# Altium schematic sheet ValdisMainboardSchematic.SchDoc
size A4; SheetNumber: 1; SheetTotal: 2; SPICEModelCacheLFLNMATP: <root> / <DocumentId>LFLNMATP</DocumentId> / </root>
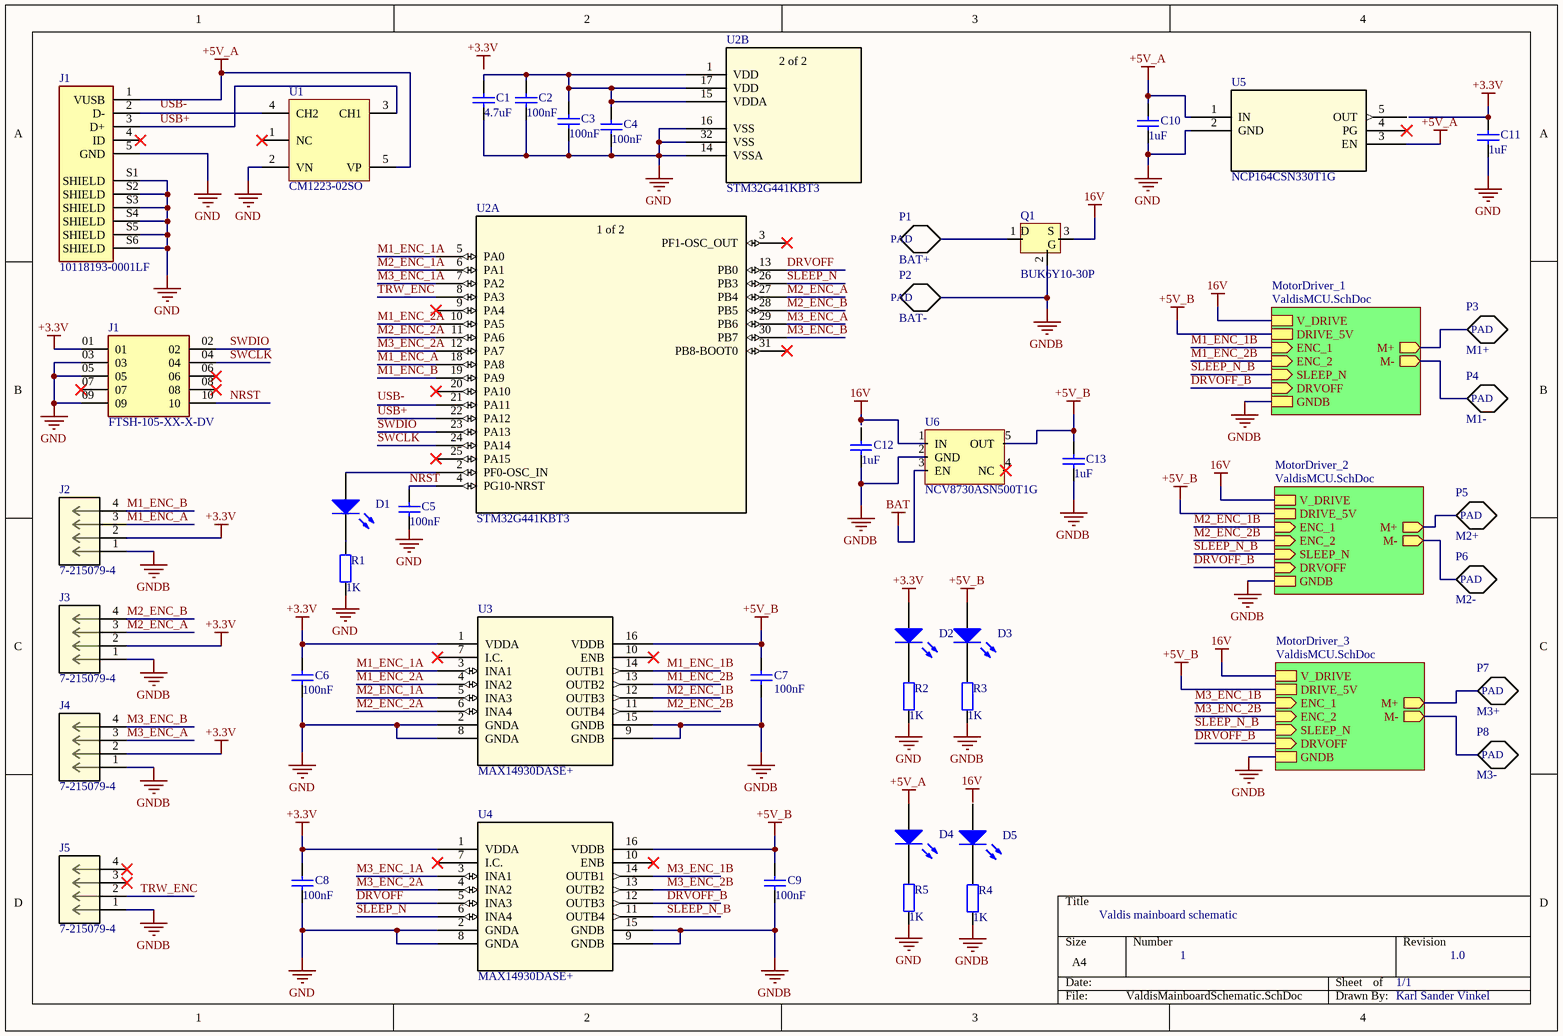
[diagram p0: ValdisMainboardSchematic.SchDoc]

## Parts
(Parts that share a designator on the sheet are numbered #1, #2 ... from top to bottom, then left to right.)
C1  value 4.7uF  (hidden comment: Capacitor)
C2  value 100nF  (hidden comment: Capacitor)
C3  value 100nF  (hidden comment: Capacitor)
C4  value 100nF  (hidden comment: Capacitor)
C5  value 100nF  (hidden comment: Capacitor)
C6  value 100nF  (hidden comment: Capacitor)
C7  value 100nF  (hidden comment: Capacitor)
C8  value 100nF  (hidden comment: Capacitor)
C9  value 100nF  (hidden comment: Capacitor)
C10  value 1uF  (hidden comment: Capacitor)
C11  value 1uF  (hidden comment: Capacitor)
C12  value 1uF  (hidden comment: Capacitor)
C13  value 1uF  (hidden comment: Capacitor)
D1  Light-Emitting Diode  (value not drawn)
D2  Light-Emitting Diode  (value not drawn)
D3  Light-Emitting Diode  (value not drawn)
D4  Light-Emitting Diode  (value not drawn)
D5  Light-Emitting Diode  (value not drawn)
J1#1  10118193-0001LF  [FCI_10118193-0001LF]
J1#2  FTSH-105-XX-X-DV  [SAMTEC_FTSH-105-XX-X-DV]
J2  7-215079-4  [CONN_7-215079-4_TEC]
J3  7-215079-4  [CONN_7-215079-4_TEC]
J4  7-215079-4  [CONN_7-215079-4_TEC]
J5  7-215079-4  [CONN_7-215079-4_TEC]
P1  BAT+
P2  BAT-
P3  M1+
P4  M1-
P5  M2+
P6  M2-
P7  M3+
P8  M3-
Q1  BUK6Y10-30P  [BUK6Y10-30P]
R1  value 1K  [AXIAL-0.4]  (hidden comment: Res2)
R2  value 1K  [AXIAL-0.4]  (hidden comment: Res2)
R3  value 1K  [AXIAL-0.4]  (hidden comment: Res2)
R4  value 1K  [AXIAL-0.4]  (hidden comment: Res2)
R5  value 1K  [AXIAL-0.4]  (hidden comment: Res2)
U1  CM1223-02SO  [ONSC-SOT23-5-527AH-01_L]
U2  STM32G441KBT3  [LQFP32_7X7_STM]  (parts A,B of 2)
U3  MAX14930DASE+  [21-0041_S16+1_MXM]
U4  MAX14930DASE+  [21-0041_S16+1_MXM]
U5  NCP164CSN330T1G  [FP-NCP164CSN330T1G_OSI]
U6  NCV8730ASN500T1G

## Sub-sheets
MotorDriver_1 = ValdisMCU.SchDoc: V_DRIVE, SLEEP_N (in), ENC_1 (in), ENC_2 (in), M+ (out), M- (out), DRVOFF (in), GNDB, DRIVE_5V
MotorDriver_2 = ValdisMCU.SchDoc: V_DRIVE, SLEEP_N (in), ENC_1 (in), ENC_2 (in), M+ (out), M- (out), DRVOFF (in), GNDB, DRIVE_5V
MotorDriver_3 = ValdisMCU.SchDoc: V_DRIVE, SLEEP_N (in), ENC_1 (in), ENC_2 (in), M+ (out), M- (out), DRVOFF (in), GNDB, DRIVE_5V

## Nets
16V: Q1.3 U6.1(IN) ; sheet MotorDriver_1/V_DRIVE, sheet MotorDriver_2/V_DRIVE, sheet MotorDriver_3/V_DRIVE
+3.3V: C6.2 C8.2 C11.2 D2.1(A) J1#2.01 J2.2 J3.2 J4.2 U3.1(VDDA) U4.1(VDDA)
+5V_A: C10.2 D4.1(A) J1#1.1(VUSB) U1.5(VP) U5.1(IN) U5.3(EN)
+5V_B: C7.2 C9.2 C13.2 D3.1(A) U3.16(VDDB) U4.16(VDDB) U6.5(OUT) ; sheet MotorDriver_1/DRIVE_5V, sheet MotorDriver_2/DRIVE_5V, sheet MotorDriver_3/DRIVE_5V
BAT: U6.3(EN)
GND: C1.1 C2.1 C3.1 C4.1 C6.1 C8.1 C10.1 C11.1 J1#1.5(GND) J1#1.S1(SHIELD) J1#1.S2(SHIELD) J1#1.S3(SHIELD) J1#1.S4(SHIELD) J1#1.S5(SHIELD) J1#1.S6(SHIELD) J1#2.03 J1#2.05 J1#2.09 R1.1 R2.1 R5.1 U1.2(VN) U2.14(VSSA) U2.16(VSS) U2.32(VSS) U3.2(GNDA) U3.8(GNDA) U4.2(GNDA) U4.8(GNDA) U5.2(GND)
GNDB: C7.1 C9.1 C12.1 C13.1 J2.1 J3.1 J4.1 J5.1 P2.?1 Q1.2 R3.1 R4.1 U3.9(GNDB) U3.15(GNDB) U4.9(GNDB) U4.15(GNDB) U6.2(GND) ; sheet MotorDriver_1/GNDB, sheet MotorDriver_2/GNDB, sheet MotorDriver_3/GNDB
DRVOFF: U2.13(PB0) U4.5(INA3)
DRVOFF_B: U4.12(OUTB3) ; sheet MotorDriver_1/DRVOFF, sheet MotorDriver_2/DRVOFF, sheet MotorDriver_3/DRVOFF
M1_ENC_1A: U2.5(PA0) U3.3(INA1)
M1_ENC_1B: U3.14(OUTB1) ; sheet MotorDriver_1/ENC_1
M1_ENC_2A: U2.10(PA5) U3.4(INA2)
M1_ENC_2B: U3.13(OUTB2) ; sheet MotorDriver_1/ENC_2
M1_ENC_A: J2.3 U2.18(PA8)
M1_ENC_B: J2.4 U2.19(PA9)
M2_ENC_1A: U2.6(PA1) U3.5(INA3)
M2_ENC_1B: U3.12(OUTB3) ; sheet MotorDriver_2/ENC_1
M2_ENC_2A: U2.11(PA6) U3.6(INA4)
M2_ENC_2B: U3.11(OUTB4) ; sheet MotorDriver_2/ENC_2
M2_ENC_A: J3.3 U2.27(PB4)
M2_ENC_B: J3.4 U2.28(PB5)
M3_ENC_1A: U2.7(PA2) U4.3(INA1)
M3_ENC_1B: U4.14(OUTB1) ; sheet MotorDriver_3/ENC_1
M3_ENC_2A: U2.12(PA7) U4.4(INA2)
M3_ENC_2B: U4.13(OUTB2) ; sheet MotorDriver_3/ENC_2
M3_ENC_A: J4.3 U2.29(PB6)
M3_ENC_B: J4.4 U2.30(PB7)
NRST: C5.2 J1#2.10 U2.4(PG10-NRST)
SLEEP_N: U2.26(PB3) U4.6(INA4)
SLEEP_N_B: U4.11(OUTB4) ; sheet MotorDriver_1/SLEEP_N, sheet MotorDriver_2/SLEEP_N, sheet MotorDriver_3/SLEEP_N
SWCLK: J1#2.04 U2.24(PA14)
SWDIO: J1#2.02 U2.23(PA13)
TRW_ENC: J5.2 U2.8(PA3)
USB+: J1#1.3(D+) U1.3(CH1) U2.22(PA12)
NetC1_2: C1.2 C2.2 C3.2 C4.2 U2.1(VDD) U2.15(VDDA) U2.17(VDD)
NetD1_1: D1.1(A) U2.2(PF0-OSC_IN)
NetD1_2: D1.2(K) R1.2
NetD2_2: D2.2(K) R2.2
NetD3_2: D3.2(K) R3.2
NetD4_2: D4.2(K) R5.2
NetD5_2: D5.2(K) R4.2
NetJ1#1_2: J1#1.2(D-) U1.4(CH2)
NetP1_?1: P1.?1 Q1.1
NetP3_?1: P3.?1 ; sheet MotorDriver_1/M+
NetP4_?1: P4.?1 ; sheet MotorDriver_1/M-
NetP5_?1: P5.?1 ; sheet MotorDriver_2/M+
NetP6_?1: P6.?1 ; sheet MotorDriver_2/M-
NetP7_?1: P7.?1 ; sheet MotorDriver_3/M+
NetP8_?1: P8.?1 ; sheet MotorDriver_3/M-

Not connected (* = marked no-connect by the designer): C5 1; C12 2; D5 1(A); J1#1 4(ID)*; J1#2 06* 07* 08*; J5 3* 4*; U1 1(NC)*; U2 3(PF1-OSC_OUT)* 9(PA4)* 20(PA10)* 21(PA11) 25(PA15)* 31(PB8-BOOT0)*; U3 7(I.C.)* 10(ENB)*; U4 7(I.C.)* 10(ENB)*; U5 4(PG)* 5(OUT); U6 4(NC)*

## Notes on the sheet
- Valdis mainboard schematic
- 1
- 1/1
- 1.0
- Karl Sander Vinkel
- Labels drawn without touching a wire or pin: 16V, +3.3V, GND, USB-
- (in symbol CMP-00001-1) D; S; G
- (in symbol pad) PAD
- (in symbol STM32G441KBT3, part A) 1 of 2
- (in symbol STM32G441KBT3, part B) 2 of 2

## Library data of the parts
C1-C13 = Capacitor: SimulationGenericComponent: True
D1-D5 = LED: AF: 1; BV: 0; BV_MAX: 1e99; EG: 1.11; FC: 0.5; IBV: 0.001; IS: 1e-14; MJSW: 0.33; NTUN: 30; TNOM: 27; XTI: 3; SimulationGenericComponent: True; CJO: 0; CJP: 0; CTA: 0; CTP: 0; FCS: 0.5; FV_MAX: 1e99; IKF: 0; IKR: 0; ISR: 1e-14; JSW: 0; JTUN: 0; JTUNSW: 0; KEG: 1; KF: 0; LEVEL: 1; N: 1; NBV: 1; NR: 1; NS: 1; PHP: 1; RS: 0; TCV: 0; TLEV: 0; TLEVC: 0; TM1: 0; TM2: 0; TPB: 0; TPHP: 0; TRS: 0; TRS2: 0; TT: 0; TTT1: 0; TTT2: 0; VJ: 1; XTITUN: 3
J1#1 = 10118193-0001LF: USB - micro B USB 2.0 Receptacle Connector 5 Position Surface Mount, Right Angle; Through Hole; MF: Amphenol ICC; Availability: Unavailable; SnapEDA_Link: https://www.snapeda.com/parts/10118193-0001LF/Amphenol%20FCI/view-part/2758989/?ref=snap; MP: 10118193-0001LF; Price: None; Value: *; Package: None
J1#2 = FTSH-105-XX-X-DV: Connector Header Surface Mount 10 position 0.050" (1.27mm); Availability: Unavailable; Package: None; MP: FTSH-105-XX-X-DV; Price: None; Value: *
J2-J5 = 7-215079-4: No Description Available; Mfr_Name: TE Connectivity; Copyright: Copyright (C) 2022 Ultra Librarian. All rights reserved.; Manufacturer_Part_Number: 7-215079-4; RefDes: RefDes; Type: DEV
P1-P8 = pad
Q1 = CMP-00001-1
R1-R5 = Res2: Resistor; Published: 8-Jun-2000; LatestRevisionDate: 17-Jul-2002; LatestRevisionNote: Re-released for DXP Platform.; PackageReference: AXIAL-0.4; Publisher: Altium Limited; PackageDescription: Axial Device, Thru-Hole; 2 Leads; 0.4 in Pin Spacing
U1 = CMP-1063-00173-1: Industry First Low Capacitance ESD Protection Arrays with Backdrive Protection, 5-Pin SOT-23, Pb-Free, Tape and Reel; Manufacturer: On Semiconductor; Direction: Unidirectional; PPK Max (W): 0.225; C Max (pF): 1.5; Number of Lines: 2; ComponentLink1Description: Manufacturer URL; PackageReference: SOT23-5-527AH-01; ComponentLink3URL: http://www.onsemi.com/pub_link/Collateral/527AH.PDF; ComponentLink1URL: http://www.onsemi.com/; PackageDescription: 5-Pin Small Outline Transistor, Body 2.9 x 1.6 mm, Pitch 0.95 mm; ComponentLink2URL: http://www.onsemi.com/pub_link/Collateral/CM1223-D.PDF; PackageVersion: Rev. O, 12/2008; ComponentLink3Description: Package Specification; PartNumber: CM1223-02SO; DatasheetVersion: Rev. 6; RoHS: Pb-Free; Code_JEDEC: MO-178; ComponentLink2Description: Datasheet; Packing: Tape and Reel; Mounting Technology: Surface Mount
U2 = STM32G441KBT3: No Description Available; Mfr_Name: STMicroelectronics; Copyright: Copyright (C) 2022 Ultra Librarian. All rights reserved.; Manufacturer_Part_Number: STM32G441KBT3; RefDes: RefDes; Type: DEV
U3 U4 = MAX14930DASE+: No Description Available; Mfr_Name: Maxim Integrated Products; Copyright: Copyright (C) 2022 Ultra Librarian. All rights reserved.; Manufacturer_Part_Number: MAX14930DASE+; RefDes: RefDes; Type: DEV
U5 = NCP164CSN330T1G: No Description Available; Mfr_Name: onsemi; Copyright: Copyright (C) 2022 Ultra Librarian. All rights reserved.; Manufacturer_Part_Number: NCP164CSN330T1G; RefDes: RefDes; Type: DEV